# Altium schematic sheet 02 - Interfaces.SchDoc: Ethernet connections
size A4; DocumentNumber: 4; SheetNumber: 4; SheetTotal: 4
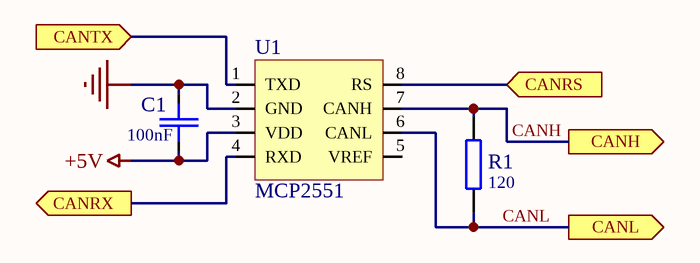
[diagram p0: 02 - Interfaces.SchDoc]

## Parts
C1  100nF  [CAP: 0805]
R1  120  [RES: 0805]
U1  MCP2551  [SOIC-8N]

## Ports
CANH (out), CANL (out), CANRS (in), CANRX (out), CANTX (in)

## Nets
+5V: C1.1 U1.3(VDD)
GND: C1.2 U1.2(GND)
CANH: R1.2 U1.7(CANH) ; port CANH
CANL: R1.1 U1.6(CANL) ; port CANL
CANRS: U1.8(RS) ; port CANRS
CANRX: U1.4(RXD) ; port CANRX
CANTX: U1.1(TXD) ; port CANTX

Not connected (* = marked no-connect by the designer): U1 5(VREF)

## Library data of the parts
C1 = C-0805: SMD-0805; Price: 0.014; Value: 100nF
R1 = R-0805: SMD 0805 0.1W 5% 150V; Price: 0.017; Value: 120